# Altium schematic sheet Sheet1.SchDoc
size A4
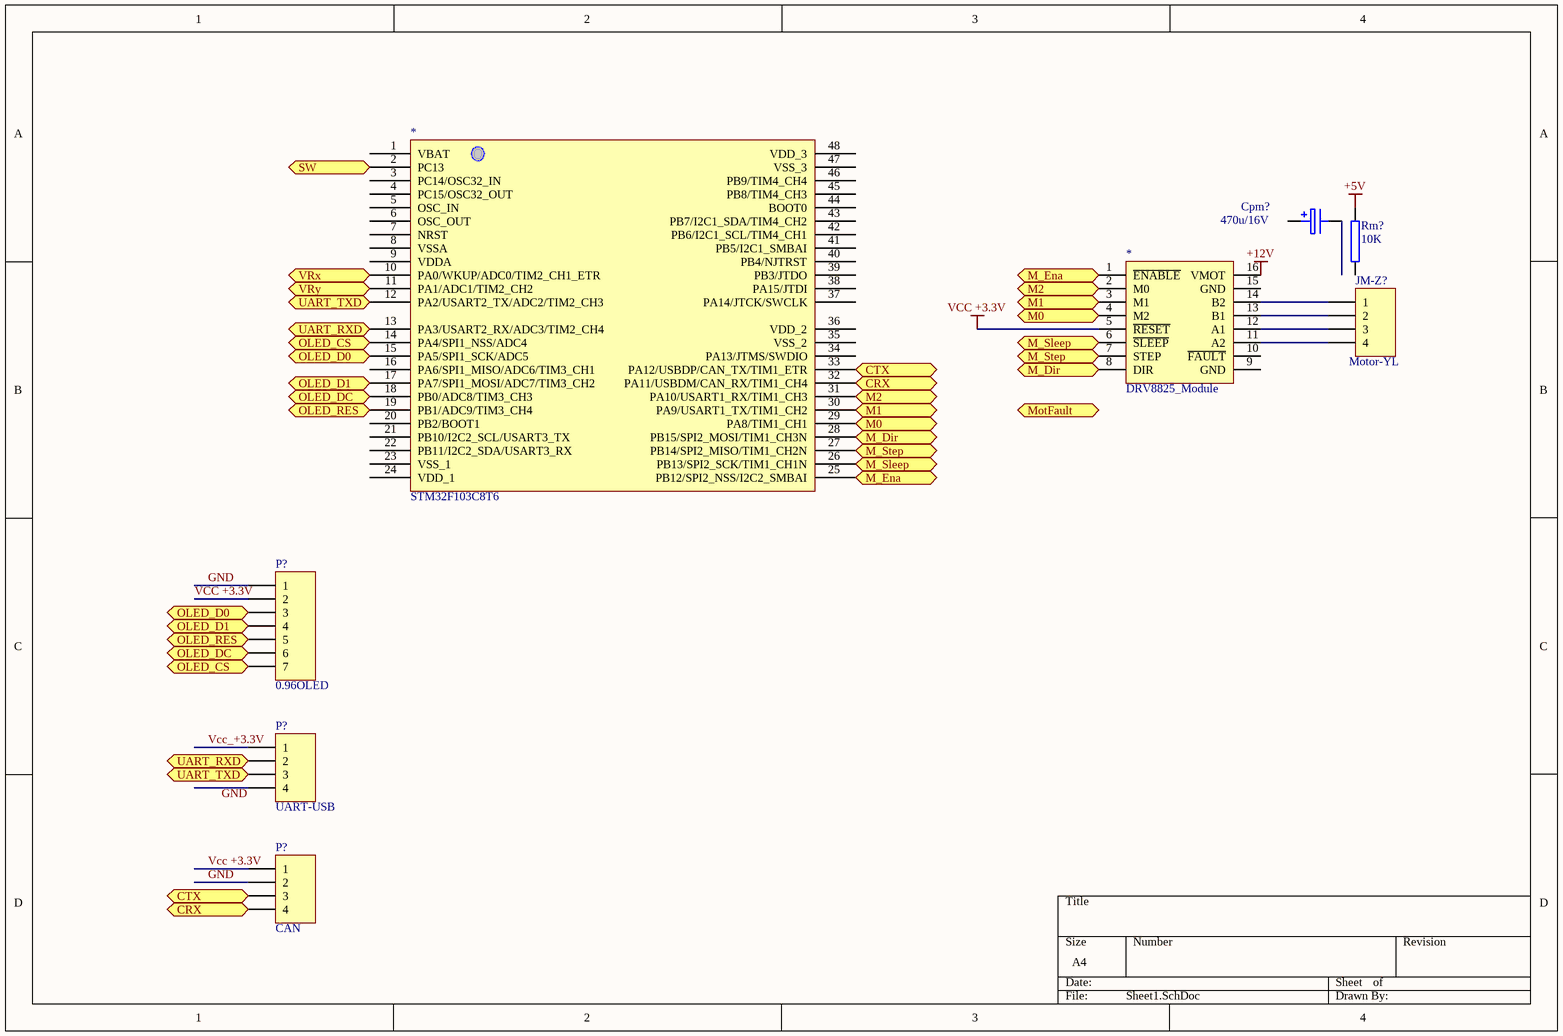
[diagram p0: Sheet1.SchDoc]

## Parts
(Parts that share a designator on the sheet are numbered #1, #2 ... from top to bottom, then left to right.)
*#1  STM32F103C8T6
*#2  DRV8825_Module
Cpm?  470u/16V
JM-Z?  Motor-YL  [HDR1X4]
P?#1  0.96OLED  [HDR1X7]
P?#2  UART-USB  [HDR1X4]
P?#3  CAN  [HDR1X4]
Rm?  10K

## Ports
CRX (in), CRX (out), CTX (in), CTX (out), M0 (out), M1 (out), M2 (out), M_Dir (in), M_Dir (out), M_Ena (in), M_Ena (out), M_Sleep (in), M_Sleep (out), M_Step (in), M_Step (out), MotFault (out), OLED_CS (in), OLED_CS (out), OLED_D0 (in), OLED_D0 (out), OLED_D1 (in), OLED_D1 (out), OLED_DC (in), OLED_DC (out), OLED_RES (in), OLED_RES (out), SW (in), UART_RXD (in), UART_RXD (out), UART_TXD (in), UART_TXD (out), VRx (in), VRy (in)

## Nets
+5V: Rm?.1
+12V: *#2.16(VMOT)
VCC +3.3V: *#2.5(~{RESET}) P?#1.2 P?#3.1
CRX: *#1.32(PA11/USBDM/CAN_RX/TIM1_CH4) P?#3.4 ; port CRX
CTX: *#1.33(PA12/USBDP/CAN_TX/TIM1_ETR) P?#3.3 ; port CTX
GND: P?#1.1 P?#3.2
M0: *#1.29(PA8/TIM1_CH1) *#2.4(M2) ; port M0
M1: *#1.30(PA9/USART1_TX/TIM1_CH2) *#2.3(M1) ; port M1
M2: *#1.31(PA10/USART1_RX/TIM1_CH3) *#2.2(M0) ; port M2
M_Dir: *#1.28(PB15/SPI2_MOSI/TIM1_CH3N) *#2.8(DIR) ; port M_Dir
M_Ena: *#1.25(PB12/SPI2_NSS/I2C2_SMBAI) *#2.1(~{ENABLE}) ; port M_Ena
M_Sleep: *#1.26(PB13/SPI2_SCK/TIM1_CH1N) *#2.6(~{SLEEP}) ; port M_Sleep
M_Step: *#1.27(PB14/SPI2_MISO/TIM1_CH2N) *#2.7(STEP) ; port M_Step
OLED_CS: *#1.14(PA4/SPI1_NSS/ADC4) P?#1.7 ; port OLED_CS
OLED_D0: *#1.15(PA5/SPI1_SCK/ADC5) P?#1.3 ; port OLED_D0
OLED_D1: *#1.17(PA7/SPI1_MOSI/ADC7/TIM3_CH2) P?#1.4 ; port OLED_D1
OLED_DC: *#1.18(PB0/ADC8/TIM3_CH3) P?#1.6 ; port OLED_DC
OLED_RES: *#1.19(PB1/ADC9/TIM3_CH4) P?#1.5 ; port OLED_RES
SW: *#1.2(PC13) ; port SW
UART_RXD: *#1.13(PA3/USART2_RX/ADC3/TIM2_CH4) P?#2.2 ; port UART_RXD
UART_TXD: *#1.12(PA2/USART2_TX/ADC2/TIM2_CH3) P?#2.3 ; port UART_TXD
Vcc_+3.3V: P?#2.1
VRx: *#1.10(PA0/WKUP/ADC0/TIM2_CH1_ETR) ; port VRx
VRy: *#1.11(PA1/ADC1/TIM2_CH2) ; port VRy
Net*#2_11: *#2.11(A2) JM-Z?.4
Net*#2_12: *#2.12(A1) JM-Z?.3
Net*#2_13: *#2.13(B1) JM-Z?.2
Net*#2_14: *#2.14(B2) JM-Z?.1

Not connected (* = marked no-connect by the designer): *#1 1(VBAT) 3(PC14/OSC32_IN) 4(PC15/OSC32_OUT) 5(OSC_IN) 6(OSC_OUT) 7(NRST) 8(VSSA) 9(VDDA) 16(PA6/SPI1_MISO/ADC6/TIM3_CH1) 20(PB2/BOOT1) 21(PB10/I2C2_SCL/USART3_TX) 22(PB11/I2C2_SDA/USART3_RX) 23(VSS_1) 24(VDD_1) 34(PA13/JTMS/SWDIO) 35(VSS_2) 36(VDD_2) 37(PA14/JTCK/SWCLK) 38(PA15/JTDI) 39(PB3/JTDO) 40(PB4/NJTRST) 41(PB5/I2C1_SMBAI) 42(PB6/I2C1_SCL/TIM4_CH1) 43(PB7/I2C1_SDA/TIM4_CH2) 44(BOOT0) 45(PB8/TIM4_CH3) 46(PB9/TIM4_CH4) 47(VSS_3) 48(VDD_3); *#2 9(GND) 10(~{FAULT}) 15(GND); Cpm? 1 2; P?#2 4; Rm? 2

## Notes on the sheet
- Labels drawn without touching a wire or pin: GND

## Library data of the parts
Cpm? = ELECTRO1: Electrolytic Capacitor
JM-Z? P?#2 P?#3 = Header 4: Header, 4-Pin; LatestRevisionDate: 17-Jul-2002; LatestRevisionNote: Re-released for DXP Platform.; Publisher: Altium Limited
P?#1 = Header 7: Header, 7-Pin; LatestRevisionDate: 17-Jul-2002; LatestRevisionNote: Re-released for DXP Platform.; Publisher: Altium Limited
Rm? = RES2